# EAGLE schematic OLM-periph-probe+ambientREVB (EAGLE 6.4)
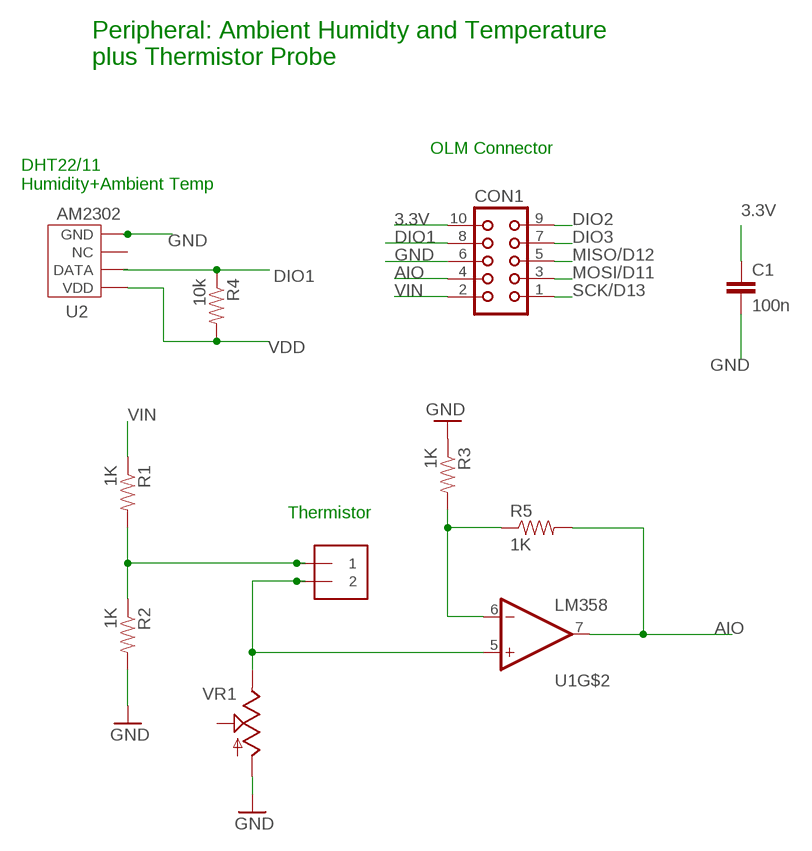
[diagram p0: schematic, sheet 1]

## Parts
C1  100n  C-EU025-024X044  [C025-024X044]
CON1  CON10L  [CON10L]
J1  1X2-3.5MM  [1X2-3.5MM]
R1  1K  RESISTORPTH1  [AXIAL-0.3]
R2  1K  RESISTORPTH1  [AXIAL-0.3]
R3  1K  RESISTORPTH1  [AXIAL-0.3]
R4  10k  RESISTORPTH1  [AXIAL-0.3]
R5  1K  RESISTORPTH1  [AXIAL-0.3]
U1  LM358  [DIP08]
U2  AM2302  [AM2302]
VR1  10K  POT  [ALPS_POT]

## Nets
3.3V: C1.1 CON1.10
AIO: CON1.4 R5.P$2 U1.7(OUT)
DIO1: CON1.8 R4.P$1 U2.P$2(DATA)
DIO2: CON1.9
DIO3: CON1.7
GND: C1.2 CON1.6 R2.P$2 R3.P$1 U2.P$4(GND) VR1.P$3(A)
MISO/D12: CON1.5
MOSI/D11: CON1.3
N$1: R3.P$2 R5.P$1 U1.6(-IN)
N$2: J1.1 R1.P$2 R2.P$1
N$3: J1.2 U1.5(+IN) VR1.P$1(E)
SCK/D13: CON1.1
VDD: R4.P$2 U2.P$1(VDD)
VIN: CON1.2 R1.P$1
Unconnected: U1.1(OUT) U1.2(-IN) U1.3(+IN) U2.P$3(NC) VR1.P$2(S)

## Notes on the sheet
- Peripheral: Ambient Humidty and Temperature
  plus Thermistor Probe
- OLM Connector
- DHT22/11
  Humidity+Ambient Temp
- Thermistor

## Power pins joined to a net without a drawn wire
V+: U1.8(V+)
V-: U1.4(V-)

## Library data of the parts
C1 = resistor:C-EU: CAPACITOR, European symbol
CON1 = con-harting:CON10L: CONNECTOR; OC_FARNELL: unknown; OC_NEWARK: unknown
J1 = adafruit:1X2: 3.5mm Terminal block http://www.ladyada.net/library/pcb/eaglelibrary.html
R1-R5 = SparkFun:RESISTOR: Resistor Basic schematic elements and footprints for 0603, 1206, and PTH 1/10th watt (small) resistors.
U1 = SparkFun:LM358
U2 = sensor:AM2302
VR1 = SparkFun:POT

## Net classes
1 power: width 0.813 mm, drill 0.254 mm, clearance 0.254 mm